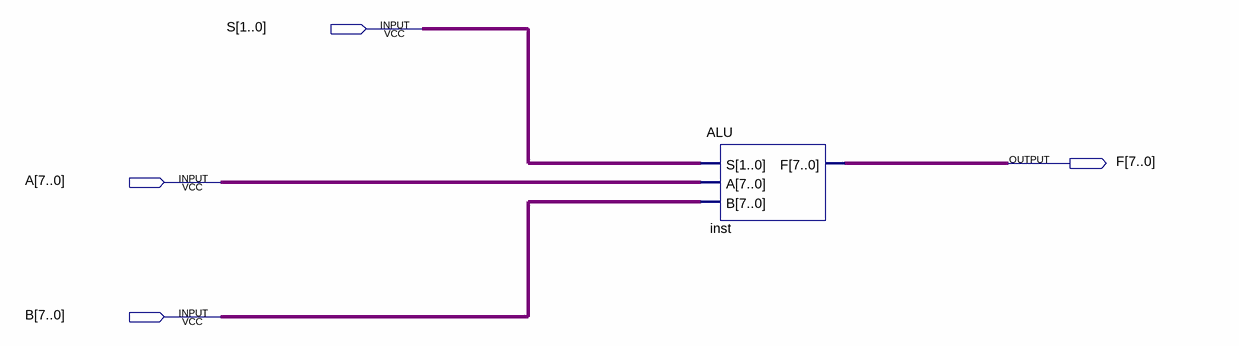
[diagram p0: schematic sheet]
// Quartus schematic ALUBLOCK.bdf as structural Verilog: 1 symbols, 4 pins
module ALUBLOCK (
  input  [1:0] S,
  input  [7:0] A,
  input  [7:0] B,
  output [7:0] F
);

  ALU inst (.S(S), .A(A), .B(B), .F(F));
endmodule
